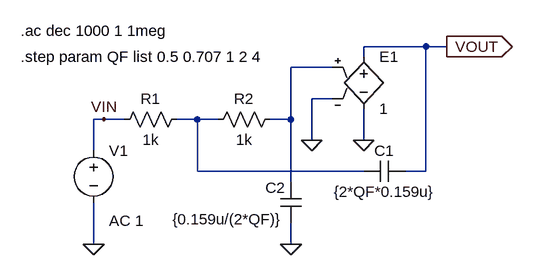
[diagram p0: schematic fig-02-07-04(a).asc]
fig-02-07-04(a).asc, the LTspice schematic file:
Version 4
SHEET 1 880 680
WIRE 304 64 208 64
WIRE 336 64 304 64
WIRE 208 80 208 64
WIRE 160 96 96 96
WIRE 160 144 128 144
WIRE -192 176 -208 176
WIRE -160 176 -192 176
WIRE -48 176 -80 176
WIRE -16 176 -48 176
WIRE 96 176 96 96
WIRE 96 176 64 176
WIRE 128 208 128 144
WIRE 208 208 208 160
WIRE -208 224 -208 176
WIRE -48 256 -48 176
WIRE 208 256 -48 256
WIRE 304 256 304 64
WIRE 304 256 272 256
WIRE 96 272 96 176
WIRE -208 368 -208 304
WIRE 96 368 96 336
FLAG 96 368 0
FLAG -208 368 0
FLAG 336 64 VOUT
IOPIN 336 64 Out
FLAG -192 176 VIN
FLAG 208 208 0
FLAG 128 208 0
SYMBOL cap 80 272 R0
WINDOW 0 -23 9 Left 2
WINDOW 3 -166 58 Left 2
SYMATTR InstName C2
SYMATTR Value {0.159u/(2*QF)}
SYMBOL cap 272 240 R90
WINDOW 0 0 32 VBottom 2
WINDOW 3 32 32 VTop 2
SYMATTR InstName C1
SYMATTR Value {2*QF*0.159u}
SYMBOL res 80 160 R90
WINDOW 0 0 56 VBottom 2
WINDOW 3 32 56 VTop 2
SYMATTR InstName R2
SYMATTR Value 1k
SYMBOL res -64 160 R90
WINDOW 0 0 56 VBottom 2
WINDOW 3 32 56 VTop 2
SYMATTR InstName R1
SYMATTR Value 1k
SYMBOL voltage -208 208 R0
WINDOW 123 24 124 Left 2
WINDOW 39 0 0 Left 2
SYMATTR Value2 AC 1
SYMATTR InstName V1
SYMATTR Value ""
SYMBOL e 208 64 R0
SYMATTR InstName E1
SYMATTR Value 1
TEXT -320 80 Left 2 !.step param QF list 0.5 0.707 1 2 4
TEXT -320 40 Left 2 !.ac dec 1000 1 1meg

The netlist it stands for:
* fig-02-07-04(a).asc
C2 N001 0 {0.159u/(2*QF)}
C1 VOUT N002 {2*QF*0.159u}
R2 N001 N002 1k
R1 N002 VIN 1k
V1 VIN 0 AC 1
E1 VOUT 0 N001 0 1
.step param QF list 0.5 0.707 1 2 4
.ac dec 1000 1 1meg
.backanno
.end